# EAGLE schematic IV-18_clock (EAGLE 6.4)
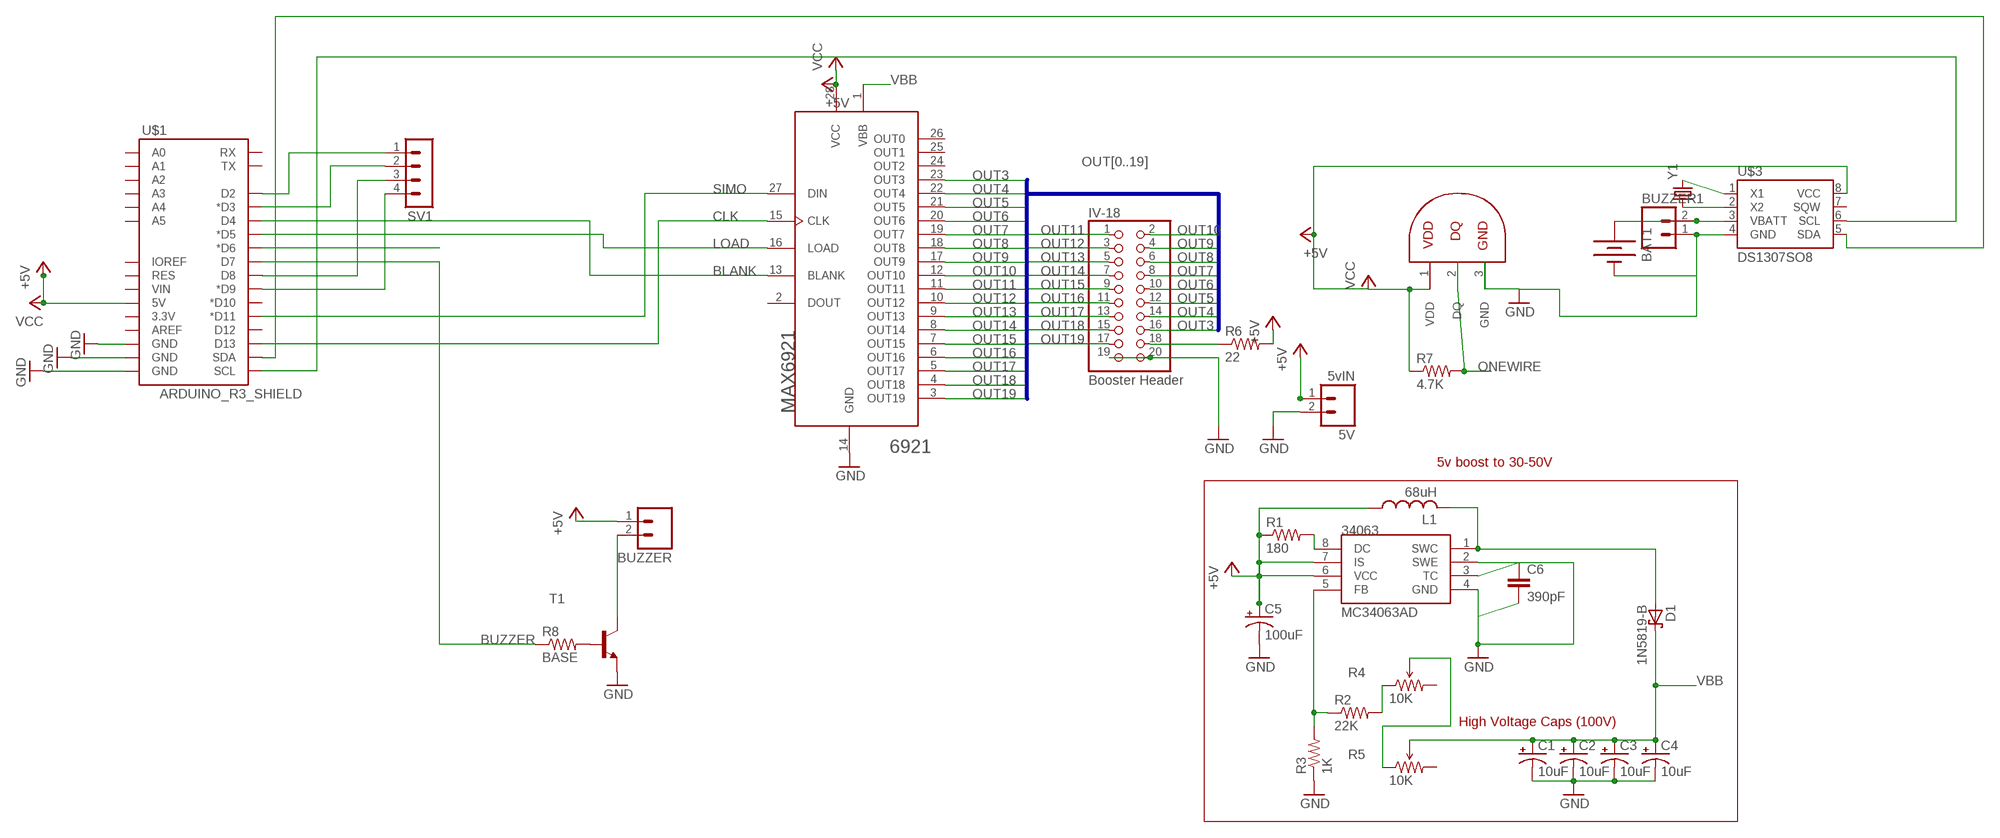
[diagram p0: schematic, sheet 1]

## Parts
5V  5vIN  M02PTH  [1X02]
6921  MAX6921_AFSOIC(W)  [SO28L]
34063  MC34063AD  [SOIC8]
BAT1  BATTERY20PTH  [BATTCOM_20MM_PTH]
BUZZER  M02PTH  [1X02]
BUZZER1  M02PTH  [1X02]
C1  10uF  CPOL-USE2.5-6  [E2,5-6]
C2  10uF  CPOL-USE2.5-6  [E2,5-6]
C3  10uF  CPOL-USE2.5-6  [E2,5-6]
C4  10uF  CPOL-USE2.5-6  [E2,5-6]
C5  100uF  CPOL-USE2.5-6  [E2,5-6]
C6  390pF  CAPPTH1  [CAP-PTH-5MM]
D1  1N5819-B  [DO41-7.6]
DS18B20  DS18B20  [TO92-CBE@1]
IV-18  Booster Header  PINHD-2X10  [2X10]
L1  68uH  L-US6000-XXX-RC  [6000-XXXX-RC]
R1  180  R-US_0204/7  [0204/7]
R2  22K  R-US_0204/7  [0204/7]
R3  1K  R-US_0204/7  [0204/7]
R4  10K  TRIMPOTPTH  [TRIM_POT_PTH]
R5  10K  TRIMPOTPTH  [TRIM_POT_PTH]
R6  22  R-US_0204/7  [0204/7]
R7  4.7K  R-US_0204/7  [0204/7]
R8  BASE  R-US_0204/7  [0204/7]
SV1  MA04-1  [MA04-1]
T1  2N3904-NPN-TO92-EBC  [TO92-EBC]
U$1  ARDUINO_R3_SHIELD  [UNO_R3_SHIELD]
U$3  DS1307SO8  [SO08]
Y1  CRYSTALTC26H_EZ  [TC26HEZ]

## Nets
+5V: 5V.1 6921.28(VCC) 34063.6(VCC) 34063.7(IS) BUZZER.1 C5.+ DS18B20.1(VDD) L1.1 R1.1 R6.2 R7.1 U$1.5V U$3.8(VCC) ; supply symbol labelled VCC
BLANK: 6921.13(BLANK) U$1.D4
BUZZER: R8.1 U$1.D7
CLK: 6921.15(CLK) U$1.D13
GND: 5V.2 6921.14(GND) 34063.2(SWE) 34063.4(GND) BAT1.2(-) BUZZER1.1 C1.- C2.- C3.- C4.- C5.- C6.2 DS18B20.3(GND) IV-18.19 IV-18.20 R3.1 T1.E U$1.GND@0(GND) U$1.GND@1(GND) U$1.GND@2(GND) U$3.4(GND)
LOAD: 6921.16(LOAD) U$1.D5(*D5)
N$1: IV-18.18 R6.1
N$2: R2.2 R4.1(CCW)
N$3: 34063.1(SWC) D1.A L1.2
N$4: R4.2(WIPER) R5.1(CCW)
N$5: 34063.8(DC) R1.2
N$6: 34063.3(TC) C6.1
N$7: 34063.5(FB) R2.1 R3.2
N$8: R8.2 T1.B
N$9: SV1.1 U$1.D2
N$10: SV1.2 U$1.D3(*D3)
N$11: SV1.3 U$1.D8
N$12: BUZZER.2 T1.C
N$13: U$3.1(X1) Y1.2
N$14: U$3.2(X2) Y1.1
N$15: U$1.SCL U$3.6(SCL)
N$16: BAT1.1(+) BUZZER1.2 U$3.3(VBATT)
N$17: U$1.SDA U$3.5(SDA)
N$18: SV1.4 U$1.D9(*D9)
ONEWIRE: DS18B20.2(DQ) R7.2 U$1.D6(*D6)
OUT3: 6921.23(OUT3) IV-18.16
OUT4: 6921.22(OUT4) IV-18.14
OUT5: 6921.21(OUT5) IV-18.12
OUT6: 6921.20(OUT6) IV-18.10
OUT7: 6921.19(OUT7) IV-18.8
OUT8: 6921.18(OUT8) IV-18.6
OUT9: 6921.17(OUT9) IV-18.4
OUT10: 6921.12(OUT10) IV-18.2
OUT11: 6921.11(OUT11) IV-18.1
OUT12: 6921.10(OUT12) IV-18.3
OUT13: 6921.9(OUT13) IV-18.5
OUT14: 6921.8(OUT14) IV-18.7
OUT15: 6921.7(OUT15) IV-18.9
OUT16: 6921.6(OUT16) IV-18.11
OUT17: 6921.5(OUT17) IV-18.13
OUT18: 6921.4(OUT18) IV-18.15
OUT19: 6921.3(OUT19) IV-18.17
SIMO: 6921.27(DIN) U$1.D11(*D11)
VBB: 6921.1(VBB) C1.+ C2.+ C3.+ C4.+ D1.C R5.2(WIPER)
Unconnected: 6921.2(DOUT) 6921.24(OUT2) 6921.25(OUT1) 6921.26(OUT0) R4.3(CW) R5.3(CW) U$1.3.3V U$1.A0 U$1.A1 U$1.A2 U$1.A3 U$1.A4 U$1.A5 U$1.AREF U$1.D10(*D10) U$1.D12 U$1.IOREF U$1.RES U$1.RX U$1.TX U$1.VIN U$3.7(SQW)

## Buses
OUT[0..19]

## Notes on the sheet
- 5v boost to 30-50V
- High Voltage Caps (100V)

## Library data of the parts
5V BUZZER BUZZER1 = BergCustom:M02: Header 2 Standard 2-pin 0.1" header. Use with straight break away headers (SKU : PRT-00116), right angle break away headers (PRT-00553), swiss pins (PRT-00743), machine pins (PRT-00117), and female headers (PRT-00115). Molex polarized connector foot print use with SKU : PRT-08233 with associated crimp pins and housings.
6921 = maxim_modified:MAX6921_AF: MAX6921 76V VFD driver in TSSOP and PLCC. Can be cascaded, talk to it via SPI
34063 = mc34063:MC34063
BAT1 = SparkFun-Electromechanical:BATTERY: Battery Holders Various common sizes : AA, AAA, 20mm coin cell and 12mm coin cell. 20MM_4LEGS, BATT-10373
C1-C5 = rcl:CPOL-US: POLARIZED CAPACITOR, American symbol
C6 = SparkFun-Capacitors:CAP: Capacitor Standard 0603 ceramic capacitor, and 0.1" leaded capacitor.
D1 = diode:1N581*: 1.0A SCHOTTKY BARRIER RECTIFIER Source: http://www.diodes.com/datasheets/ds23001.pdf
DS18B20 = BergCustom:DS18B20
IV-18 = pinhead:PINHD-2X10: PIN HEADER
L1 = rcl:L-US: INDUCTOR, American symbol
R1-R3 R6-R8 = rcl:R-US_: RESISTOR, American symbol
R4 R5 = SparkFun:TRIMPOT
SV1 = BergCustom:MA04-1: PIN HEADER; OC_FARNELL: unknown; OC_NEWARK: unknown
T1 = BergCustom:*-NPN-: NPN Transistror
U$1 = SparkFun-Boards:ARDUINO_R3_SHIELD: Shield form compatible with the Arduino Uno R3.
U$3 = SparkFun-FreqCtrl:DS1307: I2C real-time clock with battery backup.
Y1 = SparkFun-FreqCtrl:CRYSTAL: Various standard crystals. Proven footprints. Spark Fun Electronics SKU : COM-00534

## Net classes
0 default: width 0.254 mm